# Altium schematic sheet S.SchDoc
size 594 x 420 mm; SheetNumber: 1; SheetTotal: 1
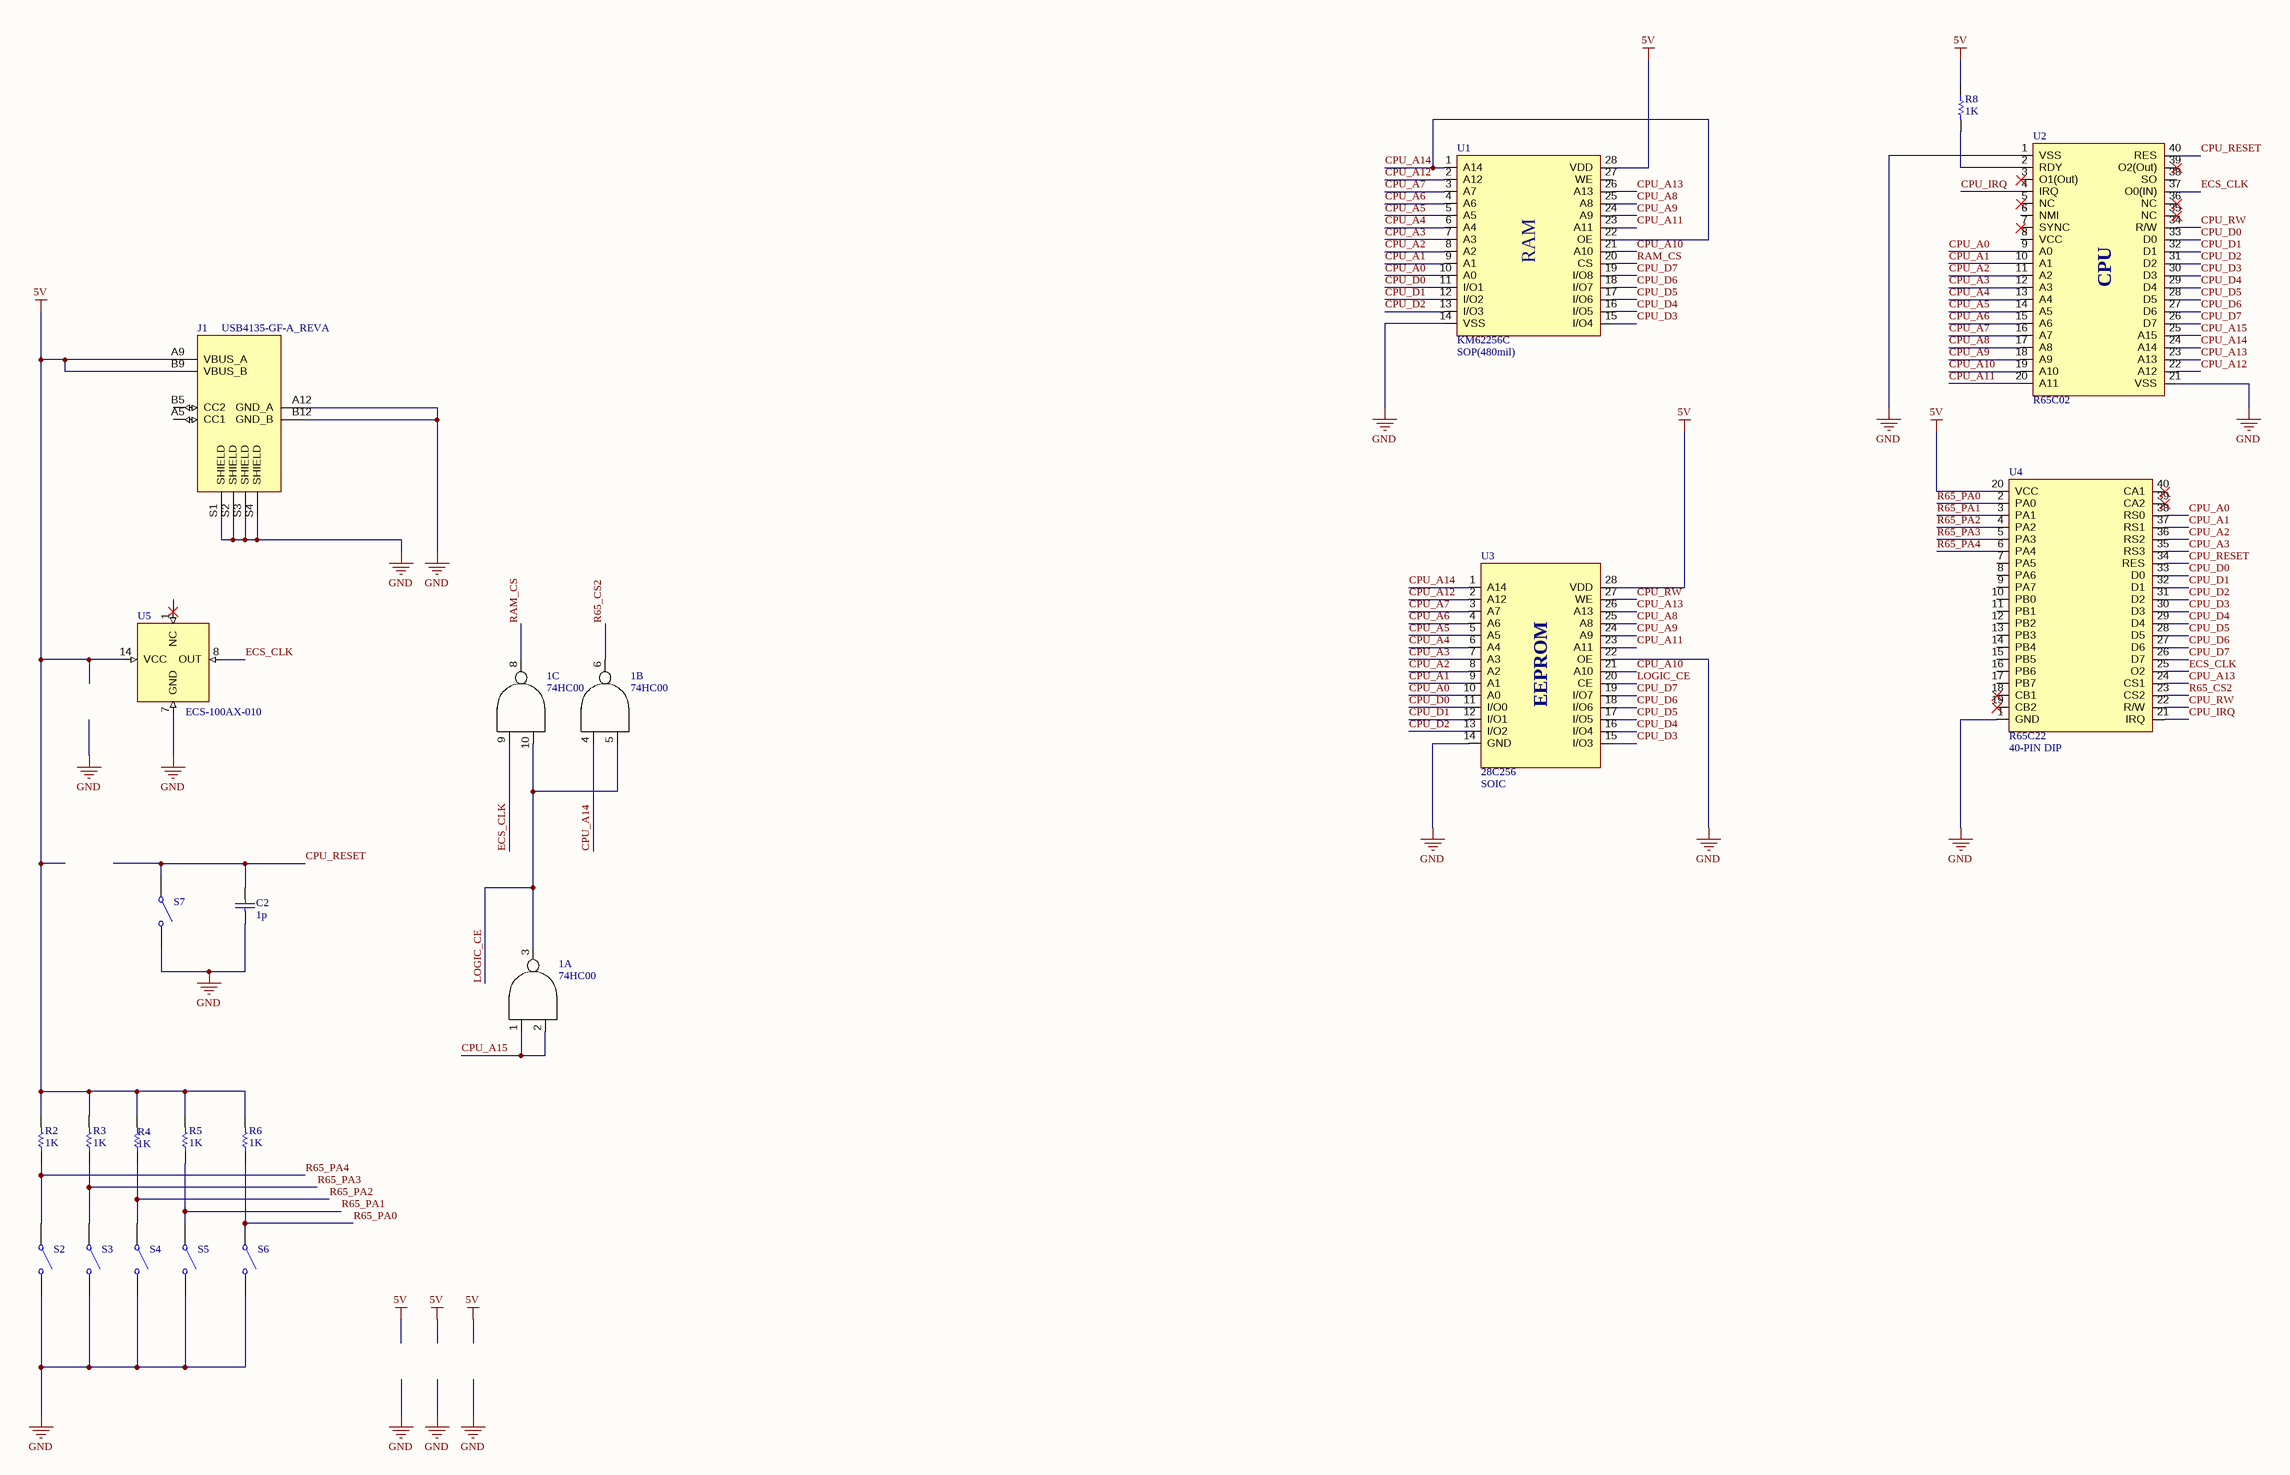
[diagram p0: S.SchDoc]

## Parts
1  74HC00  [SOIC127P600X155-14N]  (parts A,B,C of 3)
C2  value 1p  (hidden comment: Capacitor)
J1  USB4135-GF-A_REVA  [GCT_USB4135-GF-A_REVA]
R2  value 1K  (hidden comment: Resistor)
R3  value 1K  (hidden comment: Resistor)
R4  value 1K  (hidden comment: Resistor)
R5  value 1K  (hidden comment: Resistor)
R6  value 1K  (hidden comment: Resistor)
R8  value 1K  (hidden comment: Resistor)
S2  Single-Pole, Single-Throw Switch  (value not drawn)
S3  Single-Pole, Single-Throw Switch  (value not drawn)
S4  Single-Pole, Single-Throw Switch  (value not drawn)
S5  Single-Pole, Single-Throw Switch  (value not drawn)
S6  Single-Pole, Single-Throw Switch  (value not drawn)
S7  Single-Pole, Single-Throw Switch  (value not drawn)
U1  KM62256C  Package: SOP(480mil)  [SOP127P1200X279-28N]
U2  R65C02  [SOJ254P1520X356-40N]
U3  28C256  Package: SOIC  [SOIC127P1030X255-28N]
U4  R65C22  Package: 40-PIN DIP  [SOJ254P1520X356-40N]
U5  ECS-100AX-010  [Oscillator]

## Nets
5V: J1.A9(VBUS_A) J1.B9(VBUS_B) R2.2 R3.2 R4.2 R5.2 R6.2 R8.1 U1.28(VDD) U3.28(VDD) U4.20(VCC) U5.14(VCC)
GND: C2.1 J1.A12(GND_A) J1.B12(GND_B) J1.S1(SHIELD) J1.S2(SHIELD) J1.S3(SHIELD) J1.S4(SHIELD) S2.2 S3.2 S4.2 S5.2 S6.2 S7.2 U1.14(VSS) U2.1(VSS) U2.21(VSS) U3.14(GND) U3.22(OE) U4.1(GND) U5.7(GND)
CPU_A0: U1.10(A0) U2.9(A0) U3.10(A0) U4.38(RS0)
CPU_A1: U1.9(A1) U2.10(A1) U3.9(A1) U4.37(RS1)
CPU_A2: U1.8(A2) U2.11(A2) U3.8(A2) U4.36(RS2)
CPU_A3: U1.7(A3) U2.12(A3) U3.7(A3) U4.35(RS3)
CPU_A4: U1.6(A4) U2.13(A4) U3.6(A4)
CPU_A5: U1.5(A5) U2.14(A5) U3.5(A5)
CPU_A6: U1.4(A6) U2.15(A6) U3.4(A6)
CPU_A7: U1.3(A7) U2.16(A7) U3.3(A7)
CPU_A8: U1.25(A8) U2.17(A8) U3.25(A8)
CPU_A9: U1.24(A9) U2.18(A9) U3.24(A9)
CPU_A10: U1.21(A10) U2.19(A10) U3.21(A10)
CPU_A11: U1.23(A11) U2.20(A11) U3.23(A11)
CPU_A12: U1.2(A12) U2.22(A12) U3.2(A12)
CPU_A13: U1.26(A13) U2.23(A13) U3.26(A13) U4.24(CS1)
CPU_A14: 1.4(A1) U1.1(A14) U1.22(OE) U2.24(A14) U3.1(A14)
CPU_A15: 1.1(A1) 1.2(B1) U2.25(A15)
CPU_D0: U1.11(I/O1) U2.33(D0) U3.11(I/O0) U4.33(D0)
CPU_D1: U1.12(I/O2) U2.32(D1) U3.12(I/O1) U4.32(D1)
CPU_D2: U1.13(I/O3) U2.31(D2) U3.13(I/O2) U4.31(D2)
CPU_D3: U1.15(I/O4) U2.30(D3) U3.15(I/O3) U4.30(D3)
CPU_D4: U1.16(I/O5) U2.29(D4) U3.16(I/O4) U4.29(D4)
CPU_D5: U1.17(I/O6) U2.28(D5) U3.17(I/O5) U4.28(D5)
CPU_D6: U1.18(I/O7) U2.27(D6) U3.18(I/O6) U4.27(D6)
CPU_D7: U1.19(I/O8) U2.26(D7) U3.19(I/O7) U4.26(D7)
CPU_IRQ: U2.4(IRQ) U4.21(IRQ)
CPU_RESET: C2.2 S7.1 U2.40(RES) U4.34(RES)
CPU_RW: U2.34(R/W) U3.27(WE) U4.22(R/W)
ECS_CLK: 1.9(A1) U2.37(O0(IN)) U4.25(O2) U5.8(OUT)
LOGIC_CE: 1.3(Y2) 1.5(B1) 1.10(B1) U3.20(CE)
R65_CS2: 1.6(Y2) U4.23(CS2)
R65_PA0: R6.1 S6.1 U4.2(PA0)
R65_PA1: R5.1 S5.1 U4.3(PA1)
R65_PA2: R4.1 S4.1 U4.4(PA2)
R65_PA3: R3.1 S3.1 U4.5(PA3)
R65_PA4: R2.1 S2.1 U4.6(PA4)
RAM_CS: 1.8(Y2) U1.20(CS)
NetR8_2: R8.2 U2.2(RDY)

Not connected (* = marked no-connect by the designer): J1 A5(CC1) B5(CC2); U1 27(WE); U2 3(O1(Out))* 5(NC)* 6(NMI) 7(SYNC)* 8(VCC) 35(NC)* 36(NC)* 38(SO) 39(O2(Out))*; U4 7(PA5) 8(PA6) 9(PA7) 10(PB0) 11(PB1) 12(PB2) 13(PB3) 14(PB4) 15(PB5) 16(PB6) 17(PB7) 18(CB1)* 19(CB2)* 39(CA2)* 40(CA1)*; U5 1(NC)*

## Notes on the sheet
- DWG NO:
- REV:
- THIS DOCUMENT AND THE DATA DISCLOSED HEREIN OR
- HEREWITH IS THE PROPERTY OF ALTIUM LIMITED AND MAY
- BE FREELY DISTRIBUTED IN WHOLE. NO RIGHTS ARE
- RESERVED OR EXPRESS OR IMPLIED WARANTEE GIVEN.
- REVISION
- DESCRIPTION
- DATE
- APPROVED
- ENG:
- APPROVALS
- PROJECT
- DSN:
- CHK:
- REFERENCE DOCUMENTS
- PROJECT REVISION:
- TITLE
- DOCUMENT REVISION:
- DESIGN ITEM:
- BOM:
- FAB DWG:
- PCB DWG:
- ASSY DWG:
- SCALE:
- A2
- SIZE
- CAGE CODE
- FILE NAME
- DWG NO.
- SHEET
- OF
- REV
- (in symbol 28C256) EEPROM
- (in symbol 65C02) CPU
- (in symbol 62256) RAM

## Library data of the parts
1 = MM74HC00: Quad 2-Input NAND Gate; Datasheet: https://eater.net/datasheets/74hc00.pdf
C2 = Capacitor: SimulationGenericComponent: True
J1 = USB4135-GF-A_REVA: Type C Receptacle, Horizontal, SMT, For Power Charging Only; MF: Global Connector Technology; SnapEDA_Link: https://www.snapeda.com/parts/USB4135-GF-A/Global+Connector+Technology/view-part/?ref=snap; Check_prices: https://www.snapeda.com/parts/USB4135-GF-A/Global+Connector+Technology/view-part/?ref=eda; Price: None; MP: USB4135-GF-A; Value: *; Purchase-URL: https://pricing.snapeda.com/search/part/USB4135-GF-A/?ref=eda; Availability: In Stock; Package: None
R2-R6 R8 = Resistor: TC1: 0; SimulationGenericComponent: True; TC2: 0
S2-S7 = SPST SW: closed: 0; Rclosed: 1m; Ropen: 1Meg; SimulationGenericComponent: True
U1 = 62256: 32Kx8 bit Low Power CMOS Static RAM; Datasheet: https://www.futurlec.com/Memory/62256.shtml
U2 = 65C02: R65C02 family, 5V input, CPU; Datasheet: https://www.westerndesigncenter.com/wdc/documentation/w65c02s.pdf
U3 = 28C256: EEPROM memory; 32kx8bit; 4.5÷5.5V; DIP28; parallel; Datasheet: https://ww1.microchip.com/downloads/en/DeviceDoc/doc0006.pdf
U4 = R65C22: 8-bit I/O control device; Datasheet: https://datasheetspdf.com/pdf-file/502243/Rockwell/R65C22/1
U5 = ECS-100AX-010: Standard Clock Oscillators DIP-14 5V 1MHz; Datasheet: https://www.mouser.pl/datasheet/2/122/ecs-100x-4889.pdf